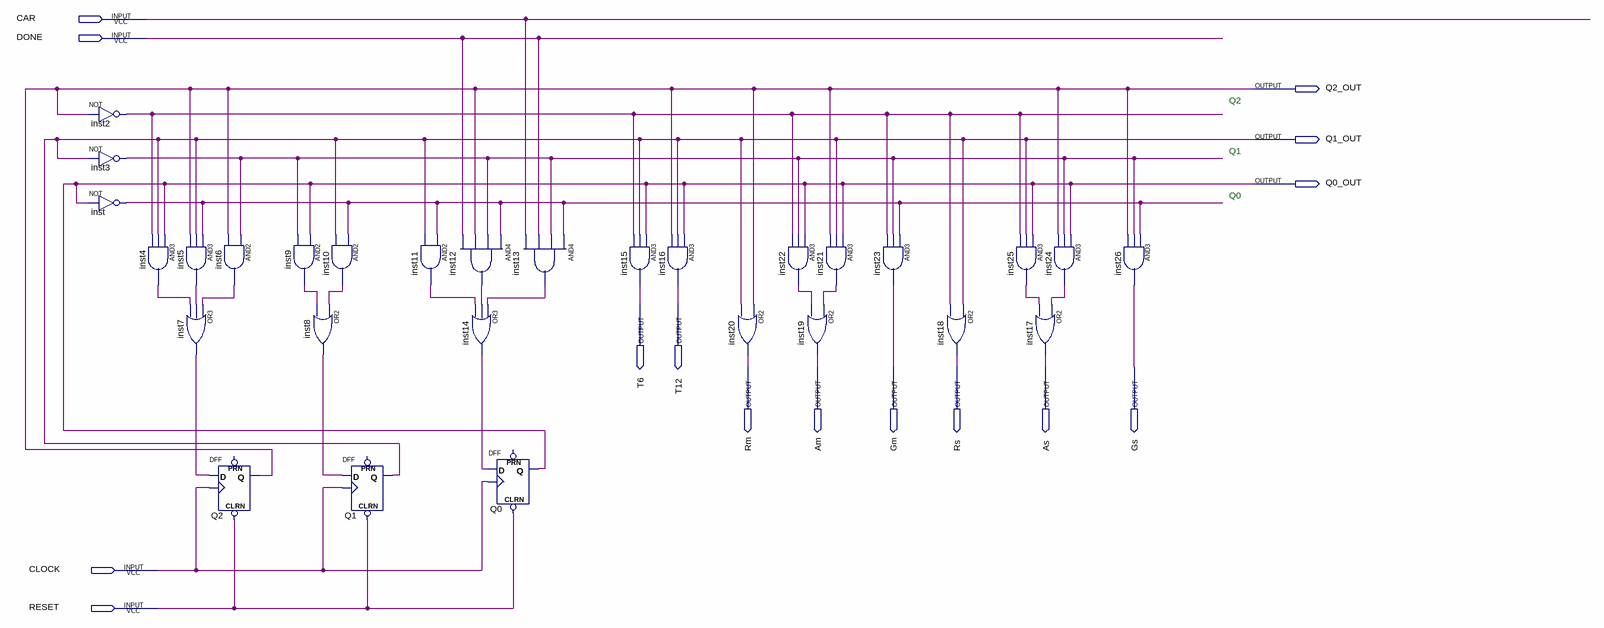
[diagram p0: schematic sheet]
// Quartus schematic tlc.bdf as structural Verilog: 29 symbols, 15 pins
module tlc (
  input  CAR,
  input  DONE,
  input  CLOCK,
  input  RESET,
  output Q2_OUT,
  output Q1_OUT,
  output Q0_OUT,
  output T6,
  output T12,
  output Rm,
  output Am,
  output Gm,
  output Rs,
  output As,
  output Gs
);

  wire inst2_out, inst3_out, inst4_out, inst5_out, inst6_out, inst7_out, inst8_out, inst9_out, inst10_out,
       inst11_out, inst12_out, inst13_out, inst14_out, inst21_out, inst22_out, inst24_out, inst25_out,
       inst_out;

  not inst2 (inst2_out, Q2_OUT);
  not inst3 (inst3_out, Q1_OUT);
  not inst (inst_out, Q0_OUT);
  and inst4 (inst4_out, Q0_OUT, Q1_OUT, inst2_out);
  and inst5 (inst5_out, inst_out, Q1_OUT, Q2_OUT);
  or inst7 (inst7_out, inst6_out, inst5_out, inst4_out);
  and inst6 (inst6_out, inst3_out, Q2_OUT);
  DFF Q2 (.CLRN(RESET), .CLK(CLOCK), .D(inst7_out), .Q(Q2_OUT));  // open: PRN
  and inst9 (inst9_out, Q0_OUT, inst3_out);
  and inst10 (inst10_out, inst_out, Q1_OUT);
  or inst8 (inst8_out, inst10_out, inst9_out);
  DFF Q1 (.CLRN(RESET), .CLK(CLOCK), .D(inst8_out), .Q(Q1_OUT));  // open: PRN
  and inst11 (inst11_out, inst_out, Q1_OUT);
  and inst12 (inst12_out, inst_out, inst3_out, Q2_OUT, DONE);
  or inst14 (inst14_out, inst13_out, inst12_out, inst11_out);
  DFF Q0 (.CLRN(RESET), .CLK(CLOCK), .D(inst14_out), .Q(Q0_OUT));  // open: PRN
  and inst13 (inst13_out, inst_out, inst3_out, DONE, CAR);
  and inst15 (T6, Q0_OUT, Q1_OUT, inst2_out);
  and inst16 (T12, Q0_OUT, Q1_OUT, Q2_OUT);
  or inst20 (Rm, Q2_OUT, Q1_OUT);
  and inst22 (inst22_out, Q0_OUT, inst3_out, inst2_out);
  or inst19 (Am, inst21_out, inst22_out);
  and inst21 (inst21_out, Q0_OUT, Q1_OUT, Q2_OUT);
  and inst23 (Gm, inst_out, inst3_out, inst2_out);
  or inst18 (Rs, Q1_OUT, inst2_out);
  and inst25 (inst25_out, Q0_OUT, Q1_OUT, inst2_out);
  and inst24 (inst24_out, Q0_OUT, inst3_out, Q2_OUT);
  or inst17 (As, inst24_out, inst25_out);
  and inst26 (Gs, inst_out, inst3_out, Q2_OUT);

  // Notes on the sheet:
  //   Q2
  //   Q1
  //   Q0
endmodule
